# EAGLE schematic light_sensor_standalone_circuit_schematics (EAGLE 9.7.0)
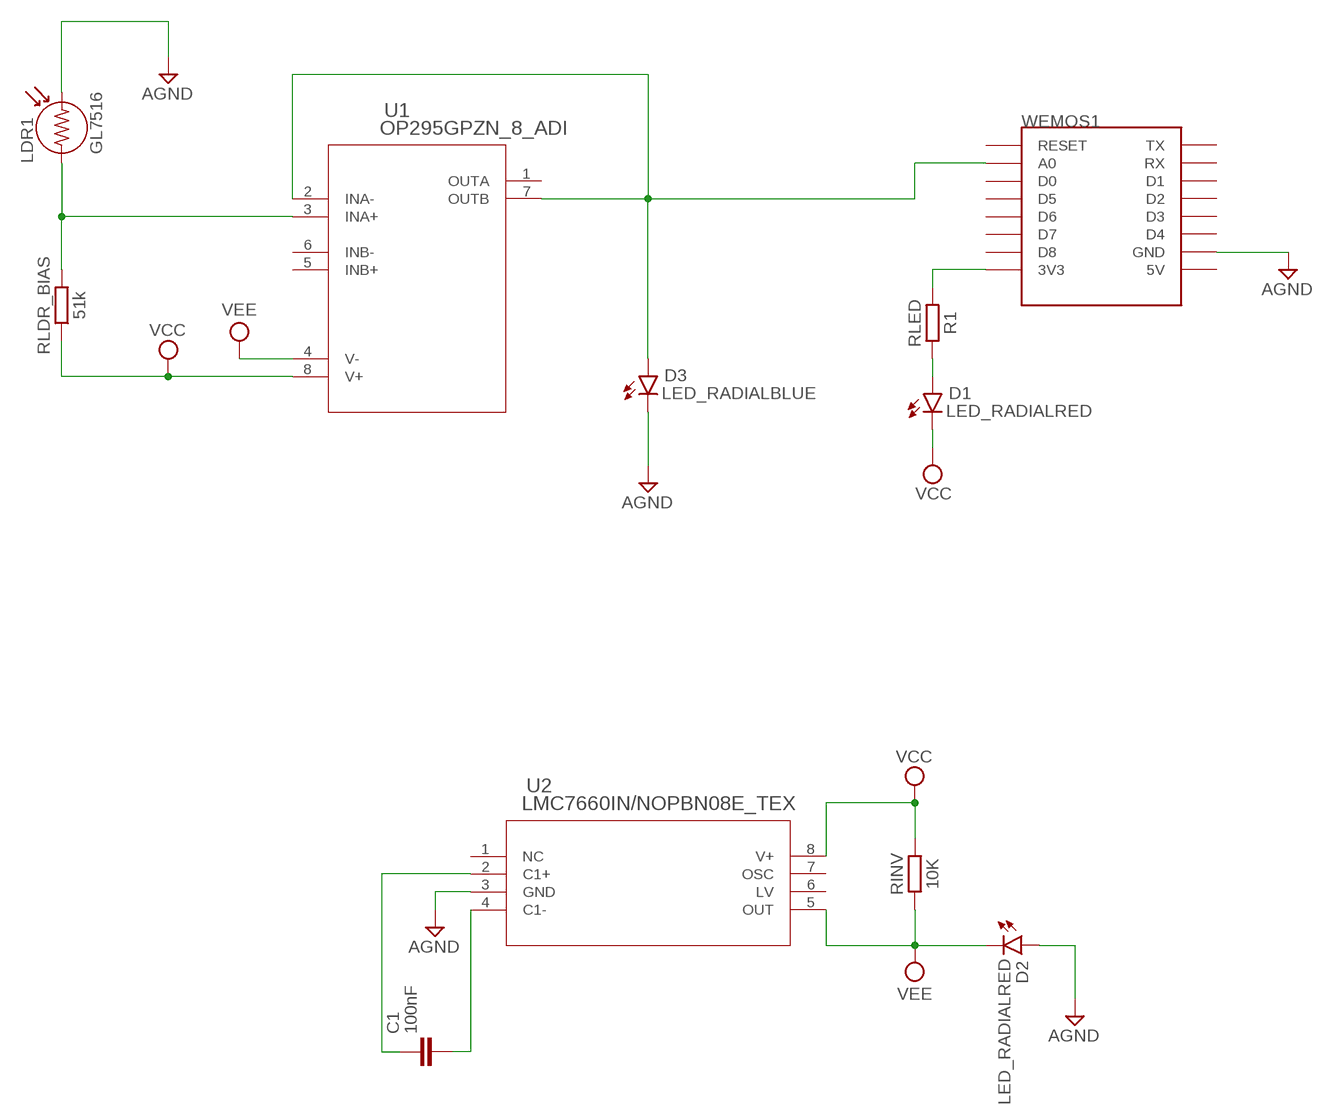
[diagram p0: schematic, sheet 1]

## Parts
C1  100nF  C_RADIAL-55.5MM-DIA  [CAPRD2261W240D5080H5555B]
D1  LED_RADIALRED  [LEDRD254W60D565H860B_R]
D2  LED_RADIALRED  [LEDRD254W60D565H860B_R]
D3  LED_RADIALBLUE  [LEDRD254W60D565H860B_B]
LDR1  GL7516  LDR  [LDR]
RINV  10K  R_AXIAL-7.2MM-PITCH  [RESAD724W46L381D178B]
RLDR_BIAS  51k  R_AXIAL-7.2MM-PITCH  [RESAD724W46L381D178B]
RLED  R1  R_AXIAL-7.2MM-PITCH  [RESAD724W46L381D178B]
U1  OP295GPZN_8_ADI  [N_8_ADI]
U2  LMC7660IN/NOPBN08E_TEX  [N08E_TEX]
WEMOS1  WEMOS-D1-MINI  [WEMOS-D1-MINI]

## Nets
AGND: D2.A D3.C LDR1.2 U2.3(GND) WEMOS1.GND
N$1: C1.1 U2.2(C1+)
N$2: C1.2 U2.4(C1-)
N$3: D3.A U1.2(INA-) U1.7(OUTB) WEMOS1.A0
N$4: RLED.2 WEMOS1.3V3
N$5: D1.A RLED.1
N$6: LDR1.1 RLDR_BIAS.2 U1.3(INA+)
VCC: D1.C RINV.2 RLDR_BIAS.1 U1.8(V+) U2.8(V+)
VEE: D2.C RINV.1 U1.4(V-) U2.5(OUT)
Unconnected: U1.1(OUTA) U1.5(INB+) U1.6(INB-) U2.1(NC) U2.6(LV) U2.7(OSC) WEMOS1.5V WEMOS1.D0 WEMOS1.D1 WEMOS1.D2 WEMOS1.D3 WEMOS1.D4 WEMOS1.D5 WEMOS1.D6 WEMOS1.D7 WEMOS1.D8 WEMOS1.RESET WEMOS1.RX WEMOS1.TX

## Library data of the parts
C1 = Capacitor:C: Capacitor - Generic; CATEGORY: Capacitor
D1-D3 = Opto-Electronic:LED_RADIAL: LED - Generic
LDR1 = sensors:LDR: Fotoresistencia
RINV RLDR_BIAS RLED = Resistor:R: Resistor Fixed - Generic; CATEGORY: Resistor; SUB-CATEGORY: Fixed
U1 = Smart_light_sensor_library:OP295GPZ; COPYRIGHT: Copyright (C) 2023 Ultra Librarian. All rights reserved.; MANUFACTURER_PART_NUMBER: OP295GPZ; MFR_NAME: Analog Devices Inc
U2 = LMC7660:LMC7660IN/NOPB; COPYRIGHT: Copyright (C) 2023 Ultra Librarian. All rights reserved.; MANUFACTURER_PART_NUMBER: LMC7660IN/NOPB; MFR_NAME: Texas Instruments
WEMOS1 = esp8266modules:WEMOS-D1-MINI: WeMos.cc D1 mini ESP8266 module